# EAGLE schematic 411_Preliminary Design_ Group8_rev4_6 (EAGLE 9.6.2)
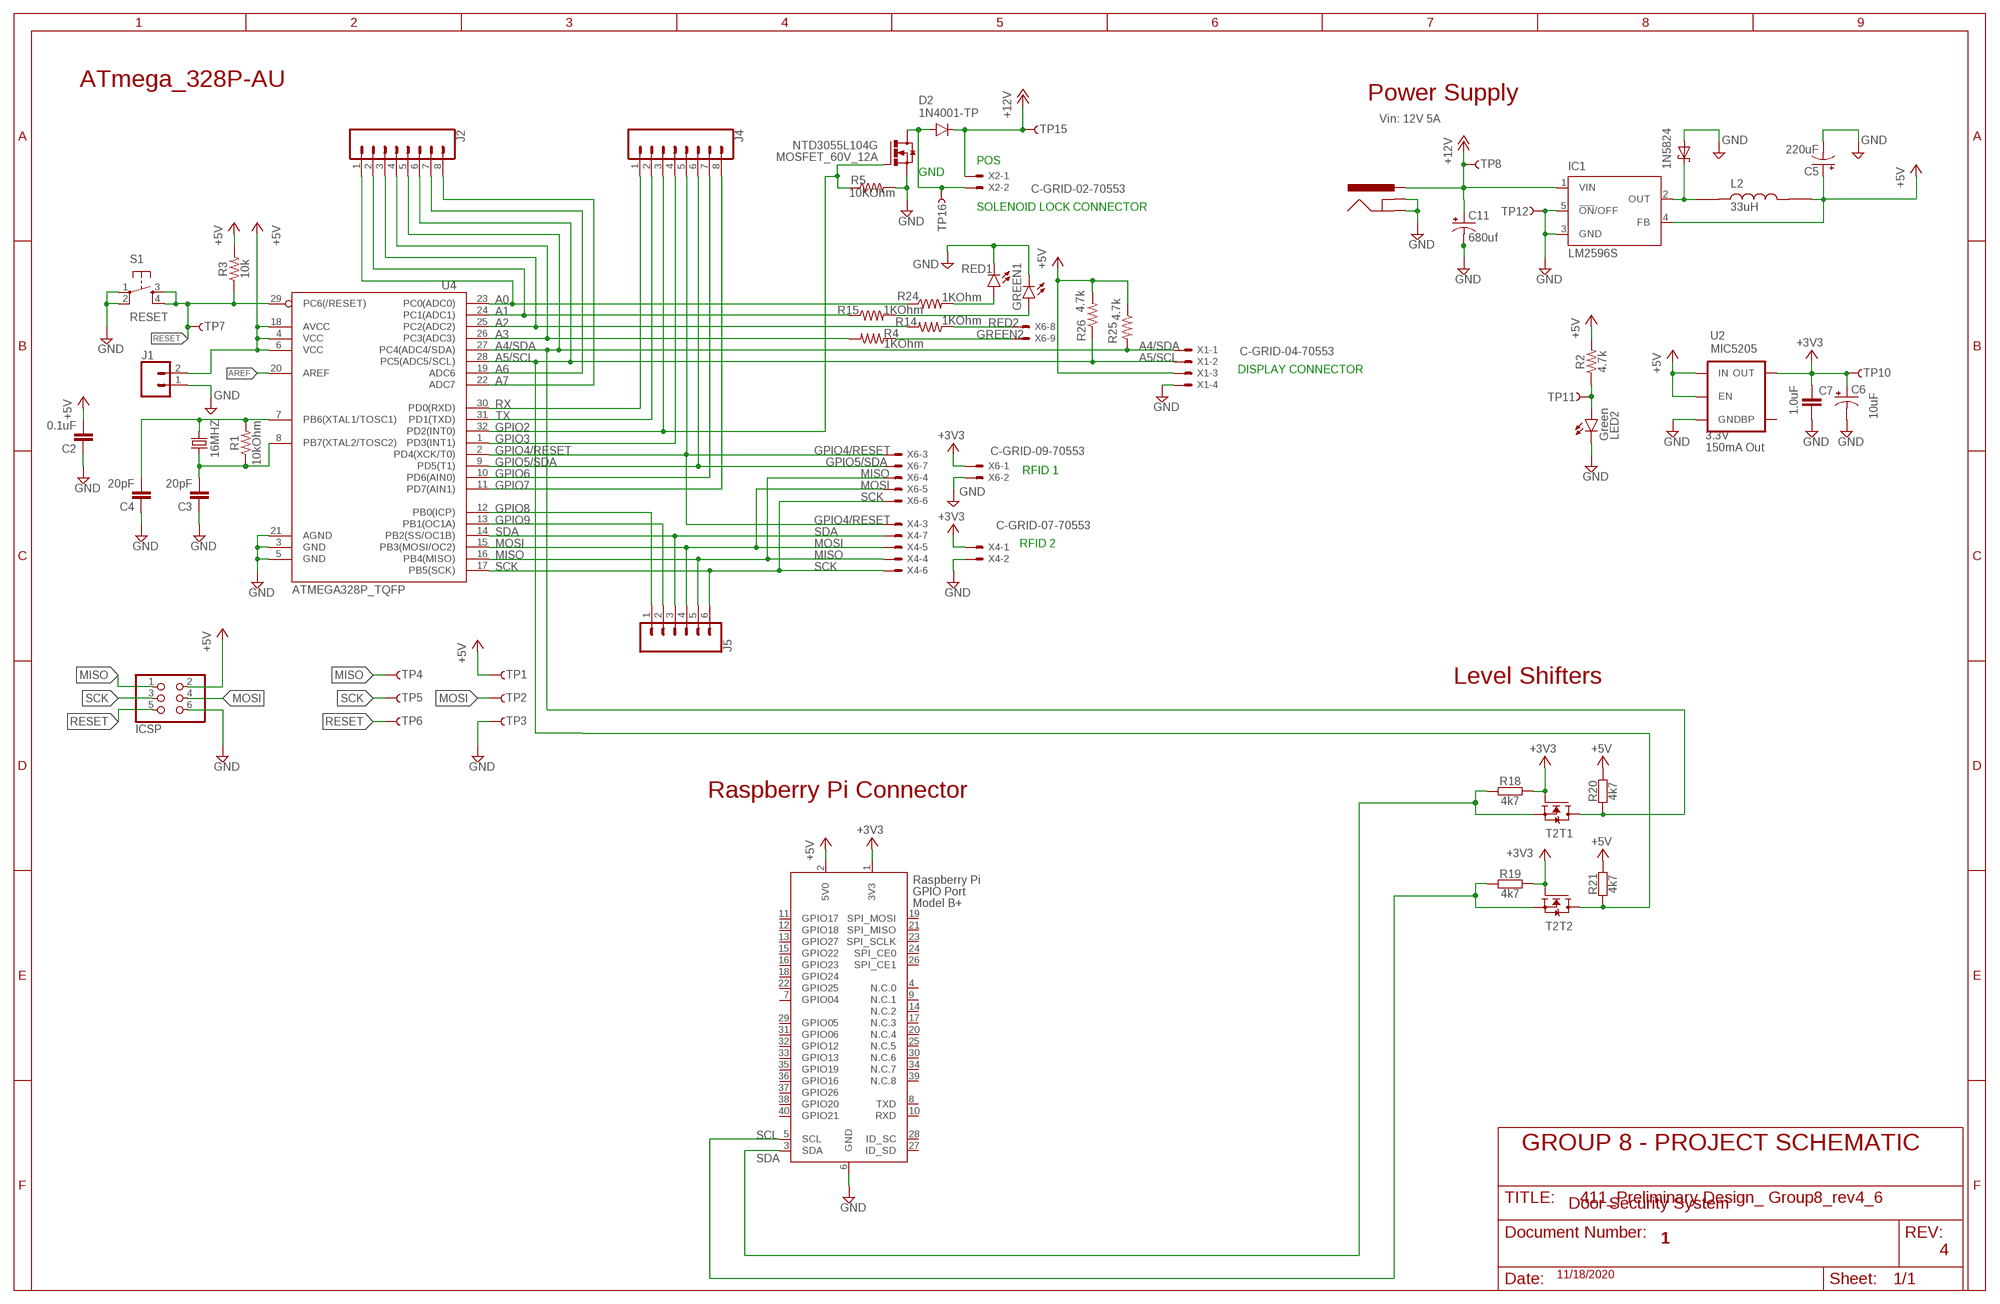
[diagram p0: schematic, sheet 1]

## Parts
1N5824  SCHOTTKY-DIODECB429-15  [CB429-15]
16MHZ  16MHZ  CRYSTALHC49S  [HC49/S]
C2  0.1uF  0.1UF-0603-25V-(+80/-20%)  [0603]
C3  20pF  0.1UF-0603-25V-(+80/-20%)  [0603]
C4  20pF  0.1UF-0603-25V-(+80/-20%)  [0603]
C5  220uF  CPOL-US153CLV-0605  [153CLV-0605]
C6  10uF  10UF-POLAR-EIA3216-16V-10%(TANT)  [EIA3216]
C7  1.0uF  1.0UF-0603-16V-10%  [0603]
C11  680uf  CPOL-US153CLV-0605  [153CLV-0605]
D2  1N4001-TP  1N4004  [DO41-10]
GREEN1  LED5MM  [LED5MM]
IC1  LM2596S  [TO263-5]
ICSP  ICSP  PINHD-2X3  [2X03]
J1  CONN_02  [1X02]
J2  CONN_08"  [1X08]
J3  POWER_JACKSUPER_BOMB_DIGITY  [POWER_JACK_SMD_OVERPASTE_SUPER_BOMB_DIGITY]
J4  CONN_08"  [1X08]
J5  CONN_06SILK_FEMALE_PTH  [1X06]
L2  33uH  #B953AS-330M=P3  [IND_#B953AS-330M=P3]
LED2  Green  LED1206  [LED-1206]
MOSFET_60V_12A  NTD3055L104G  [DPAK3]
R1  10kOhm  10KOHM-0603-1/10W-1%  [0603]
R2  4.7k  4.7KOHM-0603-1/10W-1%  [0603]
R3  10k  10KOHM-0603-1/10W-1%  [0603]
R4  1KOhm  R-US_M1406  [M1406]
R5  10KOhm  R-US_M1406  [M1406]
R14  1KOhm  R-US_M1406  [M1406]
R15  1KOhm  R-US_M1406  [M1406]
R18  4k7  RESISTOR-0402  [C0402]
R19  4k7  RESISTOR-0402  [C0402]
R20  4k7  RESISTOR-0402  [C0402]
R21  4k7  RESISTOR-0402  [C0402]
R24  1KOhm  R-US_M1406  [M1406]
R25  4.7k  4.7KOHM-0603-1/10W-1%  [0603]
R26  4.7k  4.7KOHM-0603-1/10W-1%  [0603]
RED1  LED5MM  [LED5MM]
S1  RESET  SWITCH_SPST_4_PINSQUARE  [TACTILE-SWITCH-SMD]
T2  BSS138PS  [SOT363]
TP1  TP-3x5  TEST-POINT3X5  [PAD.03X.05]
TP2  TP-3x5  TEST-POINT3X5  [PAD.03X.05]
TP3  TP-3x5  TEST-POINT3X5  [PAD.03X.05]
TP4  TP-3x5  TEST-POINT3X5  [PAD.03X.05]
TP5  TP-3x5  TEST-POINT3X5  [PAD.03X.05]
TP6  TP-3x5  TEST-POINT3X5  [PAD.03X.05]
TP7  TP-3x5  TEST-POINT3X5  [PAD.03X.05]
TP8  TP-3x5  TEST-POINT3X5  [PAD.03X.05]
TP10  TP-3x5  TEST-POINT3X5  [PAD.03X.05]
TP11  TP-3x5  TEST-POINT3X5  [PAD.03X.05]
TP12  TP-3x5  TEST-POINT3X5  [PAD.03X.05]
TP15  TP-3x5  TEST-POINT3X5  [PAD.03X.05]
TP16  TP-3x5  TEST-POINT3X5  [PAD.03X.05]
U2  MIC5205  MIC52053.3V  [SOT23-5]
U4  ATMEGA328P_TQFP  [TQFP32-08]
X1  C-GRID-04-70553  [70553-04]
X2  C-GRID-02-70553  [70553-02]
X4  C-GRID-07-70553  [70553-07]
X5  RASPI_BOARD_B+_E4P  [RASPI_BOARD_B+_EDGES_4DRILL_PAD]
X6  C-GRID-09-70553  [70553-09]

## Nets
+3V3: C6.+ C7.1 R18.2 R19.2 T2.2(T1:G) T2.5(T2:G) TP10.P$1 U2.5(OUT) X4.1 X5.1(3V3) X6.1
+5V: C2.2 C5.+ IC1.4(FB) ICSP.2 J1.2 L2.2 R2.2 R3.2 R20.2 R21.2 R25.1 R26.2 TP1.P$1 U2.1(IN) U2.3(EN) U4.4(VCC) U4.6(VCC) U4.18(AVCC) X1.3 X5.2(5V0)
+12V: C11.+ D2.C IC1.1(VIN) J3.VIN0(PWR) TP8.P$1 TP15.P$1 X2.1
A0: J2.1 R24.1 U4.23(PC0(ADC0))
A1: J2.2 R15.1 U4.24(PC1(ADC1))
A2: J2.3 R14.2 U4.25(PC2(ADC2))
A3: J2.4 R4.2 U4.26(PC3(ADC3))
A4/SDA: J2.5 R20.1 R25.2 T2.6(T1:D) U4.27(PC4(ADC4/SDA)) X1.1
A5/SCL: J2.6 R21.1 R26.1 T2.3(T2:D) U4.28(PC5(ADC5/SCL)) X1.2
A6: J2.7 U4.19(ADC6)
A7: J2.8 U4.22(ADC7)
AREF: U4.20(AREF)
GND: 1N5824.A C2.1 C3.1 C4.1 C5.- C6.- C7.2 C11.- GREEN1.K(C) IC1.3(GND) IC1.5(!ON!/OFF) ICSP.6 J1.1 J3.GND(GNDBREAK) J3.P$4(GND) LED2.C MOSFET_60V_12A.2(S) R5.2 RED1.K(C) S1.1 S1.2 TP3.P$1 TP12.P$1 U2.2(GND) U4.3(GND) U4.5(GND) U4.21(AGND) X1.4 X4.2 X5.6(GND) X6.2
GPIO2: J4.3 MOSFET_60V_12A.1(G) R5.1 U4.32(PD2(INT0))
GPIO3: J4.4 U4.1(PD3(INT1))
GPIO4/RESET: J4.5 U4.2(PD4(XCK/T0)) X4.3 X6.3
GPIO5/SDA: J4.6 U4.9(PD5(T1)) X6.7
GPIO6: J4.7 U4.10(PD6(AIN0))
GPIO7: J4.8 U4.11(PD7(AIN1))
GPIO8: J5.1 U4.12(PB0(ICP))
GPIO9: J5.2 U4.13(PB1(OC1A))
GREEN2: R4.1 X6.9
MISO: ICSP.1 J5.5 TP4.P$1 U4.16(PB4(MISO)) X4.4 X6.4
MOSI: ICSP.4 J5.4 TP2.P$1 U4.15(PB3(MOSI/OC2)) X4.5 X6.5
N$1: 1N5824.C IC1.2(OUT) L2.1
N$2: LED2.A R2.1 TP11.P$1
N$3: 16MHZ.2 C4.2 R1.2 U4.7(PB6(XTAL1/TOSC1))
N$4: 16MHZ.1 C3.2 R1.1 U4.8(PB7(XTAL2/TOSC2))
N$5: D2.A MOSFET_60V_12A.3(D) TP16.P$1 X2.2
N$9: GREEN1.A R15.2
N$12: R24.2 RED1.A
RED2: R14.1 X6.8
RESET: ICSP.5 R3.1 S1.3 S1.4 TP6.P$1 TP7.P$1 U4.29(PC6(/RESET))
RX: J4.1 U4.30(PD0(RXD))
SCK: ICSP.3 J5.6 TP5.P$1 U4.17(PB5(SCK)) X4.6 X6.6
SCL: R19.1 T2.4(T2:S) X5.5(SCL)
SDA: J5.3 R18.1 T2.1(T1:S) U4.14(PB2(SS/OC1B)) X4.7 X5.3(SDA)
TX: J4.2 U4.31(PD1(TXD))
Unconnected: U2.4(BP) X5.4(N.C.0) X5.7(GPIO04) X5.8(TXD) X5.9(N.C.1) X5.10(RXD) X5.11(GPIO17) X5.12(GPIO18) X5.13(GPIO27) X5.14(N.C.2) X5.15(GPIO22) X5.16(GPIO23) X5.17(N.C.3) X5.18(GPIO24) X5.19(SPI_MOSI) X5.20(N.C.4) X5.21(SPI_MISO) X5.22(GPIO25) X5.23(SPI_SCLK) X5.24(SPI_CE0) X5.25(N.C.5) X5.26(SPI_CE1) X5.27(ID_SD) X5.28(ID_SC) X5.29(GPIO05) X5.30(N.C.6) X5.31(GPIO06) X5.32(GPIO12) X5.33(GPIO13) X5.34(N.C.7) X5.35(GPIO19) X5.36(GPIO16) X5.37(GPIO26) X5.38(GPIO20) X5.39(N.C.8) X5.40(GPIO21)

## Notes on the sheet
- ATmega_328P-AU
- Power Supply
- Vin: 12V 5A
- POS
- GND
- SOLENOID LOCK CONNECTOR
- DISPLAY CONNECTOR
- 3.3V
  150mA Out
- RFID 1
- RFID 2
- Level Shifters
- Level Shifter
- Raspberry Pi Connector
- GROUP 8 - PROJECT SCHEMATIC
- Door Security System
- 1
- 4
- 11/18/2020

## Library data of the parts
1N5824 = adafruit:SCHOTTKY-DIODE: Schottky Diode
16MHZ = crystal:CRYSTAL: CRYSTAL; OC_FARNELL: 1667008; OC_NEWARK: unknown
C2 = SparkFun-Capacitors:0.1UF: 0.1µF ceramic capacitors A capacitor is a passive two-terminal electrical component used to store electrical energy temporarily in an electric field.; PROD_ID: CAP-00810
C3 C4 = SparkFun-Capacitors:0.1UF: 0.1µF ceramic capacitors A capacitor is a passive two-terminal electrical component used to store electrical energy temporarily in an electric field.; PROD_ID: CAP-00810; VALUE: 0.1uF
C5 C11 = rcl:CPOL-US: POLARIZED CAPACITOR, American symbol; SPICEPREFIX: C
C6 = SparkFun-Capacitors:10UF-POLAR: 10.0µF polarized capacitors A capacitor is a passive two-terminal electrical component used to store electrical energy temporarily in an electric field.; PROD_ID: CAP-00811
C7 = SparkFun-Capacitors:1.0UF: 1µF ceramic capacitors A capacitor is a passive two-terminal electrical component used to store electrical energy temporarily in an electric field.; PROD_ID: CAP-00868
D2 = diode:1N4004: DIODE general purpose rectifier, 1 A
GREEN1 = led:LED: LED OSRAM: - CHIPLED LG R971, LG N971, LY N971, LG Q971, LY Q971, LO R971, LY R971 LH N974, LH R974 LS Q976, LO Q976, LY Q976 LO Q996 - Hyper CHIPLED LW Q18S LB Q993, LB Q99A, LB R99A - SideLED LS A670, LO A670, LY A670, LG A670, LP A670 LB A673, LV A673, LT A673, LW A673 LH A674 LY A675 LS A676, LA A676, LO A676, LY A676, LW A676 LS A679, LY A679, LG A679 - Hyper Micro SIDELED® LS Y876, LA Y876, LO Y876, LY Y876 LT Y87S - SmartLED LW L88C, LW L88S LB L89C, LB L89S, LG L890 LS L89K, LO L89K, LY L89K LS L896, LA L896, LO L896, LY L896 - TOPLED LS T670, LO T670, LY T670, LG T670, LP T670 LSG T670, LSP T670, LSY T670, LOP T670, LYG T670 LG T671, LOG T671, LSG T671 LB T673, LV T673, LT T673, LW T673 LH T674 LS T676, LA T676, LO T676, LY T676, LB T676, LH T676, LSB T676, LW T676 LB T67C, LV T67C, LT T67C, LS T67K, LO T67K, LY T67K, LW E67C LS E67B, LA E67B, LO E67B, LY E67B, LB E67C, LV E67C, LT E67C LW T67C LS T679, LY T679, LG T679 LS T770, LO T770, LY T770, LG T770, LP T770 LB T773, LV T773, LT T773, LW T773 LH T774 LS E675, LA E675, LY E675, LS T675 LS T776, LA T776, LO T776, LY T776, LB T776 LHGB T686 LT T68C, LB T68C - Hyper Mini TOPLED® LB M676 - Mini TOPLED Santana® LG M470 LS M47K, LO M47K, LY M47K Source: http://www.osram.convergy.de LUXEON: - LUMILED® LXK2-PW12-R00, LXK2-PW12-S00, LXK2-PW14-U00, LXK2-PW14-V00 LXK2-PM12-R00, LXK2-PM12-S00, LXK2-PM14-U00 LXK2-PE12-Q00, LXK2-PE12-R00, LXK2-PE12-S00, LXK2-PE14-T00, LXK2-PE14-U00 LXK2-PB12-K00, LXK2-PB12-L00, LXK2-PB12-M00, LXK2-PB14-N00, LXK2-PB14-P00, LXK2-PB14-Q00 LXK2-PR12-L00, LXK2-PR12-M00, LXK2-PR14-Q00, LXK2-PR14-R00 LXK2-PD12-Q00, LXK2-PD12-R00, LXK2-PD12-S00 LXK2-PH12-R00, LXK2-PH12-S00 LXK2-PL12-P00, LXK2-PL12-Q00, LXK2-PL12-R00 Source: www.luxeon.com KINGBRIGHT: KA-3528ASYC Source: www.kingbright.com
IC1 = national-semiconductor:LM2596: SIMPLE SWITCHER® Power Converter 150 kHz 3A Step-Down Voltage Regulator Source: http://www.national.com/ds/LM/LM2596.pdf; MF: NATIONAL SEMICONDUCTOR; MPN: LM2596S-ADJ/NOPB; OC_FARNELL: 9494367; OC_NEWARK: 41K3842
ICSP = pinhead:PINHD-2X3: PIN HEADER
J1 = SparkFun-Connectors:CONN_02: Multi connection point. Often used as Generic Header-pin footprint for 0.1 inch spaced/style header connections On any of the 0.1 inch spaced packages, you can populate with these: Break Away Headers - Straight <https://www.sparkfun.com/products/116> (PRT-00116) Break Away Male Headers - Right Angle <https://www.sparkfun.com/products/553> (PRT-00553) Female Headers <https://www.sparkfun.com/products/115> (PRT-00115) Break Away Headers - Machine Pin <https://www.sparkfun.com/products/117> (PRT-00117) Break Away Female Headers - Swiss Machine Pin <https://www.sparkfun.com/products/743> (PRT-00743) For SCREWTERMINALS and SPRING TERMINALS visit here: Screw Terimnals on SparkFun.com <https://www.sparkfun.com/search/results?term=Screw+Terminals> (5mm/3.5mm/2.54mm spacing) This device is also useful as a general connection point to wire up your design to another part of your project. Our various solder wires solder well into these plated through hole pads. Hook-Up Wire - Assortment (Stranded, 22 AWG) <https://www.sparkfun.com/products/11375> (PRT-11375) Hook-Up Wire - Assortment (Solid Core, 22 AWG) <https://www.sparkfun.com/products/11367> (PRT-11367) View the entire wire category on our website here <https://www.sparkfun.com/categories/141> Special notes: Molex polarized connector foot print use with: PRT-08233 with associated crimp pins and housings. 2.54_SCREWTERM for use with PRT-10571. 3.5mm Screw Terminal footprints for PRT-08084 5mm Screw Terminal footprints for use with PRT-08432
J2 J4 = SparkFun-Connectors:CONN_08: Multi connection point. Often used as Generic Header-pin footprint for 0.1 inch spaced/style header connections On any of the 0.1 inch spaced packages, you can populate with these: Break Away Headers - Straight <https://www.sparkfun.com/products/116> (PRT-00116) Break Away Male Headers - Right Angle <https://www.sparkfun.com/products/553> (PRT-00553) Female Headers <https://www.sparkfun.com/products/115> (PRT-00115) Break Away Headers - Machine Pin <https://www.sparkfun.com/products/117> (PRT-00117) Break Away Female Headers - Swiss Machine Pin <https://www.sparkfun.com/products/743> (PRT-00743) Arduino Stackable Header - 8 Pin <https://www.sparkfun.com/products/9279> (PRT-09279) For SCREWTERMINALS and SPRING TERMINALS visit here: Screw Terimnals on SparkFun.com <https://www.sparkfun.com/search/results?term=Screw+Terminals> (5mm/3.5mm/2.54mm spacing) This device is also useful as a general connection point to wire up your design to another part of your project. Our various solder wires solder well into these plated through hole pads. Hook-Up Wire - Assortment (Stranded, 22 AWG) <https://www.sparkfun.com/products/11375> (PRT-11375) Hook-Up Wire - Assortment (Solid Core, 22 AWG) <https://www.sparkfun.com/products/11367> (PRT-11367) View the entire wire category on our website here <https://www.sparkfun.com/categories/141> Special notes: Molex polarized connector foot print use with SKU : PRT-08231 with associated crimp pins and housings. 1MM SMD Version SKU: PRT-10208 NOTES ON THE VARIANTS LOCK and LOCK_LONGPADS... This footprint was designed to help hold the alignment of a through-hole component (i.e. 6-pin header) while soldering it into place. You may notice that each hole has been shifted either up or down by 0.005 of an inch from it's more standard position (which is a perfectly straight line). This slight alteration caused the pins (the squares in the middle) to touch the edges of the holes. Because they are alternating, it causes a "brace" to hold the component in place. 0.005 has proven to be the perfect amount of "off-center" position when using our standard breakaway headers. Although looks a little odd when you look at the bare footprint, once you have a header in there, the alteration is very hard to notice. Also,if you push a header all the way into place, it is covered up entirely on the bottom side.; PROD_ID: CONN-08438
J3 = Testing:POWER_JACK: Power Jack This is the standard 5.5mm barrel jack for power. The PTH is the most common, proven, reliable, footprint. All others are experimental. The Slot footprint only works if the mill layer is transmitted to the PCB fab house so be warned. Spark Fun Electronics SKU : PRT-00119. Mating wall wart : TOL-00298 (and others); PROD_ID: CONN-08106
J5 = SparkFun-Connectors:CONN_06: Multi connection point. Often used as Generic Header-pin footprint for 0.1 inch spaced/style header connections On any of the 0.1 inch spaced packages, you can populate with these: Break Away Headers - Straight <https://www.sparkfun.com/products/116> (PRT-00116) Break Away Male Headers - Right Angle <https://www.sparkfun.com/products/553> (PRT-00553) Female Headers <https://www.sparkfun.com/products/115> (PRT-00115) Break Away Headers - Machine Pin <https://www.sparkfun.com/products/117> (PRT-00117) Break Away Female Headers - Swiss Machine Pin <https://www.sparkfun.com/products/743> (PRT-00743) Arduino Stackable Header - 6 Pin <https://www.sparkfun.com/products/9280> (PRT-09280) For SCREWTERMINALS and SPRING TERMINALS visit here: Screw Terimnals on SparkFun.com <https://www.sparkfun.com/search/results?term=Screw+Terminals> (5mm/3.5mm/2.54mm spacing) This device is also useful as a general connection point to wire up your design to another part of your project. Our various solder wires solder well into these plated through hole pads. Hook-Up Wire - Assortment (Stranded, 22 AWG) <https://www.sparkfun.com/products/11375> (PRT-11375) Hook-Up Wire - Assortment (Solid Core, 22 AWG) <https://www.sparkfun.com/products/11367> (PRT-11367) View the entire wire category on our website here <https://www.sparkfun.com/categories/141>; PROD_ID: CONN-08437
L2 = _B953AS-330M_P3:#B953AS-330M=P3: Inductor Power Shielded Wirewound 3.9uH 30% 100KHz Ferrite 6A 0.014Ohm DCR 4949 T/R; DESCRIPTION: Inductor with Inductance: 33uH Tol. +/-20%, Package: 4949 (125125); DIGI-KEY_PART_NUMBER: 490-14099-1-ND; MF: Murata; MP: #B953AS-330M=P3; PACKAGE: NONSTANDARD
LED2 = SparkFun-LED:LED: LED (Generic) Standard schematic elements and footprints for 5mm, 3mm, 1206, and 0603 sized LEDs. Generic LEDs with no color specified.; PROD_ID: DIO-09910
MOSFET_60V_12A = Transistor:NTD3055L104G: 12 A, 60 V, Logic Level N−Channel DPAK/IPAK Manufacturer's datasheet <https://www.onsemi.com/pub/Collateral/NTD3055L104-D.PDF>; CREATED_BY: PCBLayout.com; MANUFACTURER: ON SEMICONDUCTORS; MPN: NTD3055L104G; PACKAGE: DPAK-4
R1 = SparkFun-Resistors:10KOHM: 10kΩ resistor A resistor is a passive two-terminal electrical component that implements electrical resistance as a circuit element. Resistors act to reduce current flow, and, at the same time, act to lower voltage levels within circuits. - Wikipedia; PROD_ID: RES-00824; VALUE: 10k
R2 R25 R26 = SparkFun-Resistors:4.7KOHM: 4.7kΩ resistor A resistor is a passive two-terminal electrical component that implements electrical resistance as a circuit element. Resistors act to reduce current flow, and, at the same time, act to lower voltage levels within circuits. - Wikipedia; PROD_ID: RES-07857
R3 = SparkFun-Resistors:10KOHM: 10kΩ resistor A resistor is a passive two-terminal electrical component that implements electrical resistance as a circuit element. Resistors act to reduce current flow, and, at the same time, act to lower voltage levels within circuits. - Wikipedia; PROD_ID: RES-00824
R4 R5 R14 R15 R24 = rcl:R-US_: RESISTOR, American symbol; SPICEPREFIX: R
R18-R21 = we-rcl:RESISTOR: Resistors all kinds in 0603 and 0402
RED1 = led:LED: LED OSRAM: - CHIPLED LG R971, LG N971, LY N971, LG Q971, LY Q971, LO R971, LY R971 LH N974, LH R974 LS Q976, LO Q976, LY Q976 LO Q996 - Hyper CHIPLED LW Q18S LB Q993, LB Q99A, LB R99A - SideLED LS A670, LO A670, LY A670, LG A670, LP A670 LB A673, LV A673, LT A673, LW A673 LH A674 LY A675 LS A676, LA A676, LO A676, LY A676, LW A676 LS A679, LY A679, LG A679 - Hyper Micro SIDELED® LS Y876, LA Y876, LO Y876, LY Y876 LT Y87S - SmartLED LW L88C, LW L88S LB L89C, LB L89S, LG L890 LS L89K, LO L89K, LY L89K LS L896, LA L896, LO L896, LY L896 - TOPLED LS T670, LO T670, LY T670, LG T670, LP T670 LSG T670, LSP T670, LSY T670, LOP T670, LYG T670 LG T671, LOG T671, LSG T671 LB T673, LV T673, LT T673, LW T673 LH T674 LS T676, LA T676, LO T676, LY T676, LB T676, LH T676, LSB T676, LW T676 LB T67C, LV T67C, LT T67C, LS T67K, LO T67K, LY T67K, LW E67C LS E67B, LA E67B, LO E67B, LY E67B, LB E67C, LV E67C, LT E67C LW T67C LS T679, LY T679, LG T679 LS T770, LO T770, LY T770, LG T770, LP T770 LB T773, LV T773, LT T773, LW T773 LH T774 LS E675, LA E675, LY E675, LS T675 LS T776, LA T776, LO T776, LY T776, LB T776 LHGB T686 LT T68C, LB T68C - Hyper Mini TOPLED® LB M676 - Mini TOPLED Santana® LG M470 LS M47K, LO M47K, LY M47K Source: http://www.osram.convergy.de LUXEON: - LUMILED® LXK2-PW12-R00, LXK2-PW12-S00, LXK2-PW14-U00, LXK2-PW14-V00 LXK2-PM12-R00, LXK2-PM12-S00, LXK2-PM14-U00 LXK2-PE12-Q00, LXK2-PE12-R00, LXK2-PE12-S00, LXK2-PE14-T00, LXK2-PE14-U00 LXK2-PB12-K00, LXK2-PB12-L00, LXK2-PB12-M00, LXK2-PB14-N00, LXK2-PB14-P00, LXK2-PB14-Q00 LXK2-PR12-L00, LXK2-PR12-M00, LXK2-PR14-Q00, LXK2-PR14-R00 LXK2-PD12-Q00, LXK2-PD12-R00, LXK2-PD12-S00 LXK2-PH12-R00, LXK2-PH12-S00 LXK2-PL12-P00, LXK2-PL12-Q00, LXK2-PL12-R00 Source: www.luxeon.com KINGBRIGHT: KA-3528ASYC Source: www.kingbright.com; SPICEPREFIX: L
S1 = SparkFun-Electromechanical:SWITCH_SPST_4_PIN; PROD_ID: SWCH-08247
T2 = we-transistor:BSS138PS: BSS138 Dual N-Channel MOSFET (UGS +/-20V, RDS 1Ohm, ID 320mA)
TP1-TP4 TP6-TP8 TP10-TP12 TP15 TP16 = SparkFun-Connectors:TEST-POINT: SparkFun Test Points Bare copper test points for troubleshooting or In-Circuit-Testing. These are used by our Production team for verifying production board runs using pogo-pins on test beds. SparkFun Products: SparkFun LSM9DS1 Breakout <https://www.sparkfun.com/products/13284> SparkFun PSOC <https://www.sparkfun.com/products/13714> SparkFun Load Cell Amplifier <https://www.sparkfun.com/products/13879>
TP5 = SparkFun-Passives:TEST-POINT: Bare copper test points for troubleshooting or ICT
U2 = SparkFun-PowerIC:MIC5205: MIC5205 150mA vreg 3.3V - VREG-00822 5V - VREG-00823; PROD_ID: VREG-00822
U4 = SparkFun-IC-Microcontroller:ATMEGA328P_TQFP: Popular 328P in QFP Storefront component: ATmega328 - TQFP <https://www.sparkfun.com/products/13448> (COM-13448) Datasheet <http://www.sparkfun.com/datasheets/Components/SMD/ATMega328.pdf> SparkFun Products SparkFun RedBoard - Programmed with Arduino <https://www.sparkfun.com/products/12757> (DEV-12757) Arduino Pro Mini 328 - 5V/16MHz <https://www.sparkfun.com/products/11113> (DEV-11113) Arduino Pro Mini 328 - 3.3V/8MHz <https://www.sparkfun.com/products/11114> (DEV-11114) SparkFun OpenLog <https://www.sparkfun.com/products/13712> (DEV-13712) SparkFun MicroView - OLED Arduino Module <https://www.sparkfun.com/products/12923> (DEV-12923) SparkFun Digital Sandbox <https://www.sparkfun.com/products/12651> (DEV-12651) SparkFun PicoBoard <https://www.sparkfun.com/products/11888> (WIG-11888) Arduino Fio <https://www.sparkfun.com/products/10116> (DEV-10116) LilyPad Arduino 328 Main Board <https://www.sparkfun.com/products/13342> (DEV-13342) SparkFun RedStick <https://www.sparkfun.com/products/13741> (DEV-13741) LilyPad MP3 <https://www.sparkfun.com/products/11013> (DEV-11013) LilyPad Arduino SimpleSnap <https://www.sparkfun.com/products/10941> (DEV-10941) SparkFun Stepoko <https://www.sparkfun.com/products/13899> (ROB-13899) SparkFun Geiger Counter <https://www.sparkfun.com/products/11345> (SEN-11345) SparkFun EL Sequencer <https://www.sparkfun.com/products/12781> (COM-12781) Arduino Pro 328 - 5V/16MHz <https://www.sparkfun.com/products/10915> (DEV-10915) CryptoCape <https://www.sparkfun.com/products/12773> (DEV-12773) SparkFun IR Thermometer Evaluation Board - MLX90614 <https://www.sparkfun.com/products/10740> (SEN-10740) SparkFun RedBot Mainboard <https://www.sparkfun.com/products/12097> (ROB-12097) Arduino Pro 328 - 3.3V/8MHz <https://www.sparkfun.com/products/10914> (DEV-10914) SparkFun Block for Intel® Edison - Arduino <https://www.sparkfun.com/products/13036> (DEV-13036) SparkFun Simon Says - Surface Mount Soldering Kit <https://www.sparkfun.com/products/10935> (KIT-10935) SparkFun 7-Segment Serial Display - Red <https://www.sparkfun.com/products/11441> (COM-11441) SparkFun 7-Segment Serial Display - White <https://www.sparkfun.com/products/11629> (COM-11629) SparkFun 7-Segment Serial Display - Yellow <https://www.sparkfun.com/products/11443> (COM-11443) SparkFun 7-Segment Serial Display - Kelly Green <https://www.sparkfun.com/products/11440> (COM-11440) SparkFun 7-Segment Serial Display - Blue <https://www.sparkfun.com/products/11442> (COM-11442) SparkFun OpenSegment Serial Display - 20mm (Blue) <https://www.sparkfun.com/products/11647> (COM-11647) SparkFun OpenSegment Serial Display - 20mm (Green) <https://www.sparkfun.com/products/11646> (COM-11646) SparkFun OpenSegment Serial Display - 20mm (White) <https://www.sparkfun.com/products/11648> (COM-11648) SparkFun OpenSegment Serial Display - 20mm (Red) <https://www.sparkfun.com/products/11644> (COM-11644) SparkFun OpenSegment Serial Display - 20mm (Yellow) <https://www.sparkfun.com/products/11645> (COM-11645) SparkFun OpenSegment Shield <https://www.sparkfun.com/products/13190> (DEV-13190); PROD_ID: IC-09069
X1 = con-molex:C-GRID-04: CONNECTOR wire to board 2.54 mm (0.100") pitch header; MF: MOLEX; OC_FARNELL: unknown; OC_NEWARK: unknown
X2 = con-molex:C-GRID-02: CONNECTOR wire to board 2.54 mm (0.100") pitch header; MF: MOLEX; OC_FARNELL: unknown; OC_NEWARK: unknown
X4 = con-molex:C-GRID-07: CONNECTOR wire to board 2.54 mm (0.100") pitch header; MF: MOLEX; OC_FARNELL: unknown; OC_NEWARK: unknown
X5 = raspberrypi_bastelstube_v13:RASPI_BOARD_B+: Raspberry Pi GPIO connector with markings for the outer dimensions of the Raspberry Pi board model B+ with different sets of drill holes or mounting pads
X6 = con-molex:C-GRID-09: CONNECTOR wire to board 2.54 mm (0.100") pitch header; MF: MOLEX; OC_FARNELL: unknown; OC_NEWARK: unknown